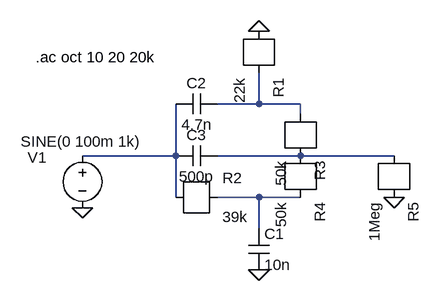
[diagram p0: schematic tone stack big muff.asc]
tone stack big muff.asc, the LTspice schematic file:
Version 4
SHEET 1 880 680
WIRE 384 368 384 320
WIRE 384 368 320 368
WIRE 448 368 384 368
WIRE 448 384 448 368
WIRE 256 448 256 368
WIRE 256 448 112 448
WIRE 448 448 320 448
WIRE 592 448 448 448
WIRE 256 512 256 448
WIRE 384 512 320 512
WIRE 448 512 384 512
WIRE 384 560 384 512
FLAG 384 624 0
FLAG 384 256 0
FLAG 592 512 0
FLAG 112 528 0
SYMBOL r 384 256 R90
SYMATTR InstName R1
SYMATTR Value 22k
SYMBOL cap 368 560 R0
SYMATTR InstName C1
SYMATTR Value 10n
SYMBOL r 256 512 R0
SYMATTR InstName R2
SYMATTR Value 39k
SYMBOL cap 320 352 R90
WINDOW 0 0 32 VBottom 2
WINDOW 3 32 32 VTop 2
SYMATTR InstName C2
SYMATTR Value 4.7n
SYMBOL r 448 384 R90
SYMATTR InstName R3
SYMATTR Value 50k
SYMBOL voltage 112 432 R0
WINDOW 0 -84 19 Left 2
WINDOW 3 -95 -6 Left 2
SYMATTR InstName V1
SYMATTR Value SINE(0 100m 1k)
SYMATTR Value2 AC 100m
SYMBOL r 448 448 R90
SYMATTR InstName R4
SYMATTR Value 50k
SYMBOL r 592 448 R90
SYMATTR InstName R5
SYMATTR Value 1Meg
SYMBOL cap 320 432 R90
WINDOW 0 0 32 VBottom 2
WINDOW 3 32 32 VTop 2
SYMATTR InstName C3
SYMATTR Value 500p
TEXT 40 296 Left 2 !.ac oct 10 20 20k

The netlist it stands for:
* tone stack big muff.asc
R1 N001 0 22k
C1 N004 0 10n
R2 N004 N002 39k
C2 N001 N002 4.7n
R3 N003 N001 50k
V1 N002 0 SINE(0 100m 1k) AC 100m
R4 N004 N003 50k
R5 0 N003 1Meg
C3 N003 N002 500p
.ac oct 10 20 20k
.backanno
.end